# Altium schematic sheet Charging.SchDoc
size A4; SheetNumber: 3; SheetTotal: 6
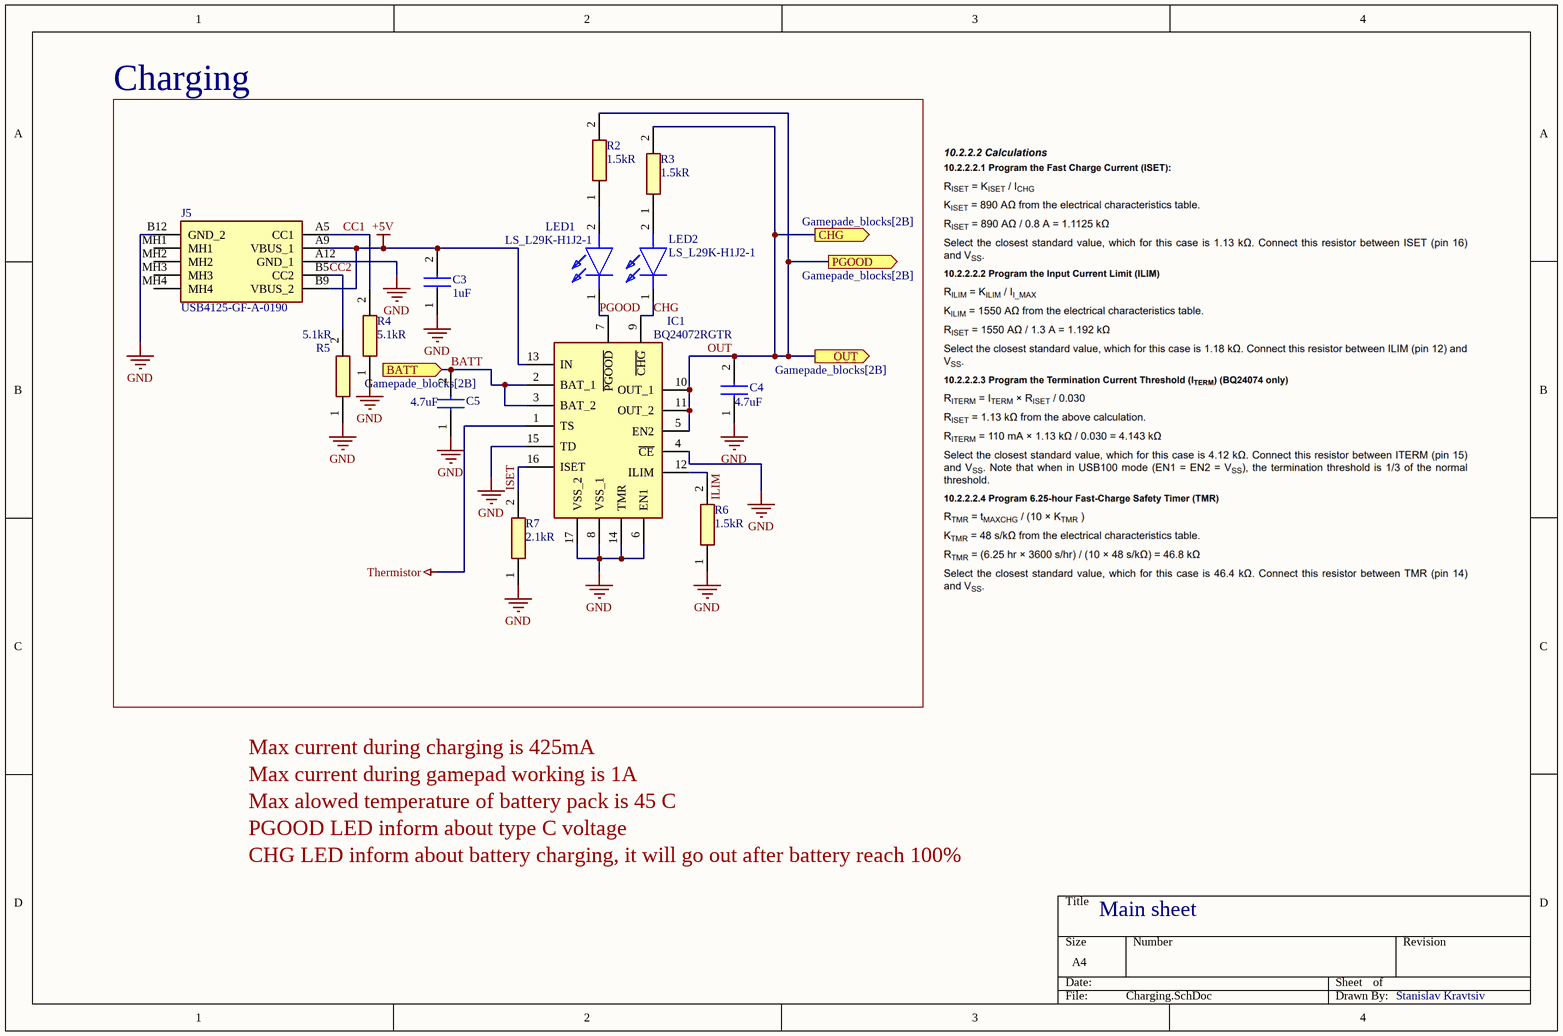
[diagram p0: Charging.SchDoc]

## Parts
C3  1uF  [C0805]
C4  4.7uF  [CAPC1608X90N]
C5  4.7uF  [CAPC1608X90N]
IC1  BQ24072RGTR  [QFN50P300X300X100-17N-D]
J5  USB4125-GF-A-0190  [USB4125GFA0190]
LED1  LS_L29K-H1J2-1  [SMT-0603]
LED2  LS_L29K-H1J2-1  [SMT-0603]
R2  1.5kR  [RESC1608X55N]
R3  1.5kR  [RESC1608X55N]
R4  5.1kR  [RESC1608X60N]
R5  5.1kR  [RESC1608X60N]
R6  1.5kR  [RESC1608X55N]
R7  2.1kR  [RESC1608X55N]

## Blocks framed on the sheet
Charging: C3-C5 IC1 J5 LED1 LED2 R2-R7

## Ports
BATT (in, see Gamepade_blocks[2B]), CHG (out, see Gamepade_blocks[2B]), OUT (out, see Gamepade_blocks[2B]), PGOOD (out, see Gamepade_blocks[2B])

## Nets
+5V: C3.2 IC1.13(IN) J5.A9(VBUS_1) J5.B9(VBUS_2)
GND: C3.1 C4.1 C5.1 IC1.4(~{CE}) IC1.6(EN1) IC1.8(VSS_1) IC1.14(TMR) IC1.15(TD) IC1.17(VSS_2) J5.A12(GND_1) J5.B12(GND_2) R4.1 R5.1 R6.1 R7.1
Thermistor: IC1.1(TS)
BATT: C5.2 IC1.2(BAT_1) IC1.3(BAT_2) ; port BATT
CC1: J5.A5(CC1) R4.2
CC2: J5.B5(CC2) R5.2
CHG: IC1.9(~{CHG}) LED2.1(K)
ILIM: IC1.12(ILIM) R6.2
ISET: IC1.16(ISET) R7.2
OUT: C4.2 IC1.5(EN2) IC1.10(OUT_1) IC1.11(OUT_2) R2.2 R3.2 ; port OUT, port PGOOD, port CHG
PGOOD: IC1.7(~{PGOOD}) LED1.1(K)
NetLED1_2: LED1.2(A) R2.1
NetLED2_2: LED2.2(A) R3.1

Not connected (* = marked no-connect by the designer): J5 MH1 MH2 MH3 MH4

## Notes on the sheet
- Max current during charging is 425mA
- Max current during gamepad working is 1A
- Max alowed temperature of battery pack is 45 C
- PGOOD LED inform about type C voltage
- CHG LED inform about battery charging, it will go out after battery reach 100%
- Main sheet
- Stanislav Kravtsiv

## Library data of the parts
C3 = 1uF: Capacitor; Manufacturer_Name: Yageo Group; Manufacturer_Part_Number: C0805C105K5RACTU; Datasheet Link: https://www.yageogroup.com/content/datasheet/asset/file/KEM_C1002_X7R_SMD; Height: 1.1mm; Mouser Part Number: 80-C0805C105K5R; Mouser Price/Stock: https://www.mouser.co.uk/ProductDetail/KEMET/C0805C105K5RACTU?qs=iP0bYSAMAFrBrUflcErrLQ%3D%3D; Arrow Part Number: C0805C105K5RACTU; Arrow Price/Stock: https://www.arrow.com/en/products/c0805c105k5ractu/kemet-corporation?region=nac
C4 C5 = CL10A475KP8NNNC: Capacitor; Manufacturer_Name: SAMSUNG; Datasheet Link: https://www.arrow.com/en/products/cl10a475kp8nnnc/samsung-electro-mechanics; Height: 0.9mm; Manufacturer_Part_Number: CL10A475KP8NNNC; Mouser Part Number: 187-CL10A475KP8NNNC; Mouser Price/Stock: https://www.mouser.co.uk/ProductDetail/Samsung-Electro-Mechanics/CL10A475KP8NNNC?qs=hqM3L16%252BxlfQRmkWsZz5vA%3D%3D; Arrow Part Number: CL10A475KP8NNNC; Arrow Price/Stock: https://www.arrow.com/en/products/cl10a475kp8nnnc/samsung-electro-mechanics?utm_currency=USD&region=nac
IC1 = BQ24072RGTR: Integrated Circuit; Manufacturer_Name: Texas Instruments; Datasheet Link: http://www.ti.com/lit/gpn/BQ24072; Height: 1mm; Manufacturer_Part_Number: BQ24072RGTR; Mouser Part Number: 595-BQ24072RGTR; Mouser Price/Stock: https://www.mouser.co.uk/ProductDetail/Texas-Instruments/BQ24072RGTR?qs=ZV%2Fxhq4oszo4knrw3goPOA%3D%3D; Arrow Part Number: BQ24072RGTR; Arrow Price/Stock: https://www.arrow.com/en/products/bq24072rgtr/texas-instruments.html?utm_currency=USD&region=nac
J5 = USB4125-GF-A-0190: Connector; Manufacturer_Name: GCT (GLOBAL CONNECTOR TECHNOLOGY); Datasheet Link: https://eu.mouser.com/datasheet/2/837/usb4125-2448699.pdf; Manufacturer_Part_Number: USB4125-GF-A-0190; Mouser Part Number: 640-USB4125-GF-A-190; Mouser Price/Stock: https://www.mouser.co.uk/ProductDetail/GCT/USB4125-GF-A-0190?qs=QNEnbhJQKvbCz4hEJBS24w%3D%3D
LED1 LED2 = LS_L29K-H1J2-1: LED; Manufacturer_Name: ams OSRAM; Manufacturer_Part_Number: LS L29K-H1J2-1; Mouser Part Number: 720-LSL29K-H1J2-1-Z; Mouser Price/Stock: https://www.mouser.com/Search/Refine.aspx?Keyword=720-LSL29K-H1J2-1-Z
R2 R3 R6 = RC0603FR-071K5L: Resistor; Manufacturer_Name: Yageo Group; Datasheet Link: https://www.yageo.com/upload/media/product/productsearch/datasheet/rchip/PYu-RC_Group_51_RoHS_L_12.pdf; Height: 0.55mm; Manufacturer_Part_Number: RC0603FR-071K5L; Mouser Part Number: 603-RC0603FR-071K5L; Mouser Price/Stock: https://www.mouser.co.uk/ProductDetail/YAGEO/RC0603FR-071K5L?qs=VU8sRB4EgwBMt9nc4XGNgA%3D%3D; Arrow Part Number: RC0603FR-071K5L; Arrow Price/Stock: https://www.arrow.com/en/products/rc0603fr-071k5l/yageo?utm_currency=USD&region=europe
R4 R5 = WR06X5101FTL: Resistor; Manufacturer_Name: Walsin Technology Corporation; Datasheet Link: https://componentsearchengine.com/Datasheets/2/WR06X5101FTL.pdf; Height: 0.6mm; Manufacturer_Part_Number: WR06X5101FTL
R7 = RC0603FR-072K1L: Resistor; Manufacturer_Name: Yageo Group; Datasheet Link: https://www.yageo.com/upload/media/product/products/datasheet/rchip/PYu-RC_Group_51_RoHS_L_12.pdf; Height: 0.55mm; Manufacturer_Part_Number: RC0603FR-072K1L; Mouser Part Number: 603-RC0603FR-072K1L; Mouser Price/Stock: https://www.mouser.co.uk/ProductDetail/YAGEO/RC0603FR-072K1L?qs=IuGqVx9wL0IQ8qvrNmtVmg%3D%3D; Arrow Part Number: RC0603FR-072K1L; Arrow Price/Stock: https://www.arrow.com/en/products/rc0603fr-072k1l/yageo?utm_currency=USD&region=nac